# EAGLE design untitled (EAGLE 6.1)
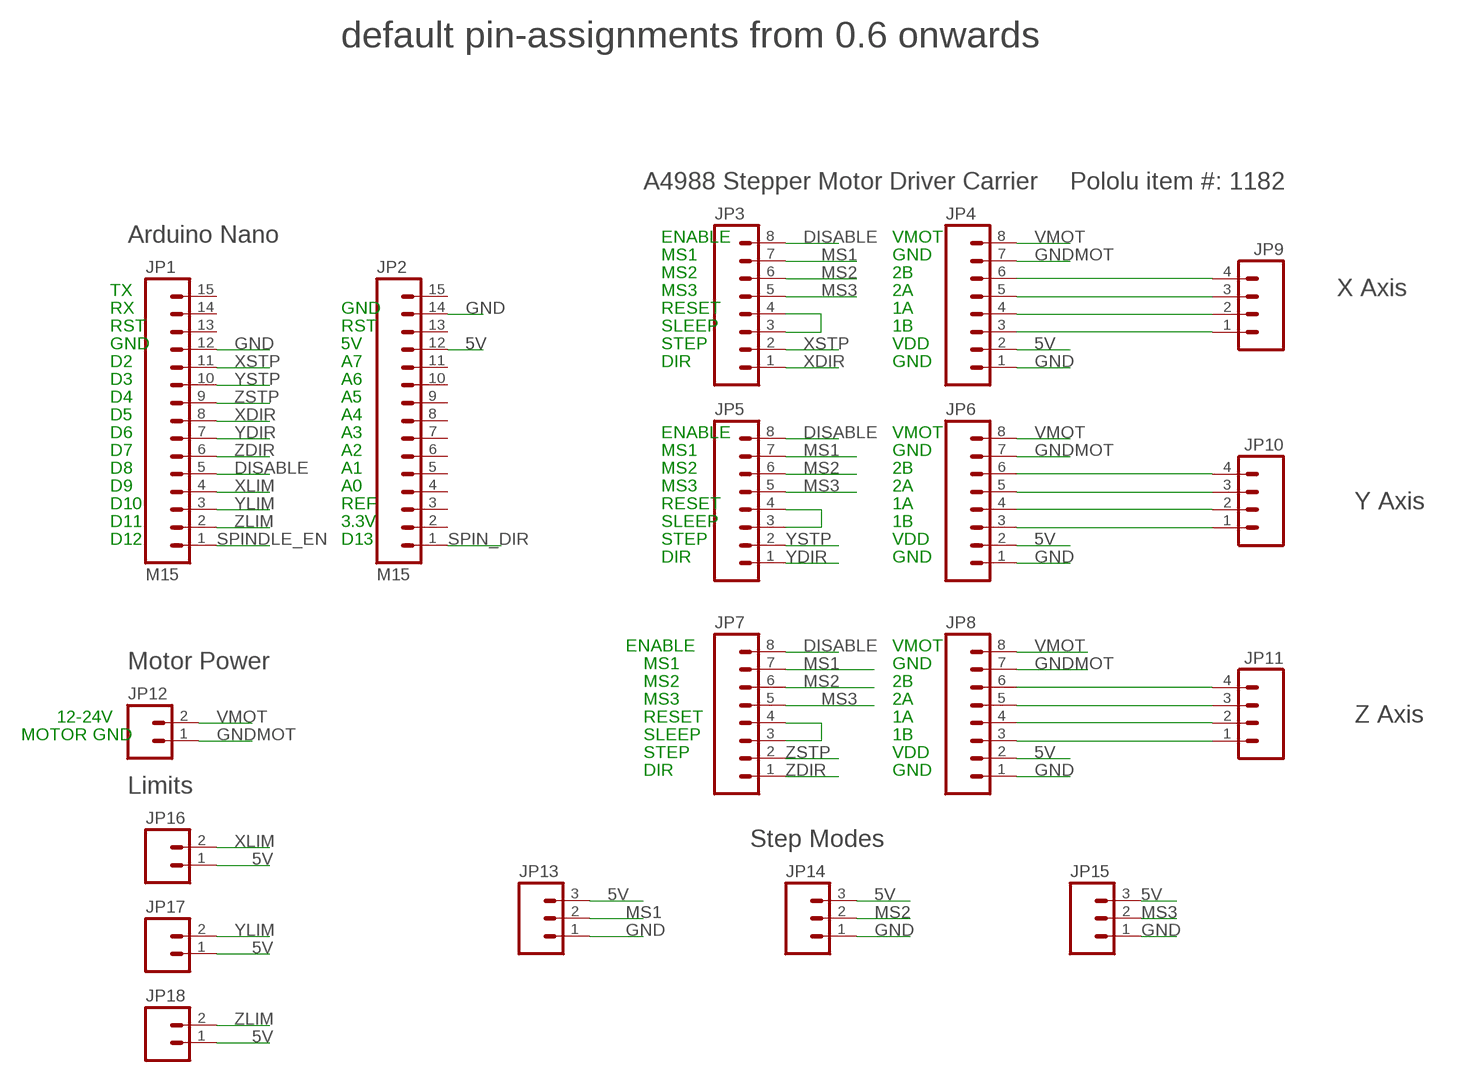
[diagram p0: schematic, sheet 1]

## Parts
JP1  M15  [1X15]
JP2  M15  [1X15]
JP3  M08LONGPADS  [1X08_LONGPADS]
JP4  M08LONGPADS  [1X08_LONGPADS]
JP5  M08LONGPADS  [1X08_LONGPADS]
JP6  M08LONGPADS  [1X08_LONGPADS]
JP7  M08LONGPADS  [1X08_LONGPADS]
JP8  M08LONGPADS  [1X08_LONGPADS]
JP9  M04LONGPADS  [1X04_LONGPADS]
JP10  M04LONGPADS  [1X04_LONGPADS]
JP11  M04LONGPADS  [1X04_LONGPADS]
JP12  M02LOCK_LONGPADS  [1X02_LOCK_LONGPADS]
JP13  M03PTH  [1X03]
JP14  M03PTH  [1X03]
JP15  M03PTH  [1X03]
JP16  M02LOCK_LONGPADS  [1X02_LOCK_LONGPADS]
JP17  M02LOCK_LONGPADS  [1X02_LOCK_LONGPADS]
JP18  M02LOCK_LONGPADS  [1X02_LOCK_LONGPADS]

## Nets
5V: JP2.12 JP4.2 JP6.2 JP8.2 JP13.3 JP14.3 JP15.3 JP16.1 JP17.1 JP18.1
DISABLE: JP1.5 JP3.8 JP5.8 JP7.8
GND: JP1.12 JP2.14 JP4.1 JP6.1 JP8.1 JP13.1 JP14.1 JP15.1
GNDMOT: JP4.7 JP6.7 JP8.7 JP12.1
MS1: JP3.7 JP5.7 JP7.7 JP13.2
MS2: JP3.6 JP5.6 JP7.6 JP14.2
MS3: JP3.5 JP5.5 JP7.5 JP15.2
N$1: JP5.3 JP5.4
N$2: JP4.6 JP9.4
N$3: JP4.5 JP9.3
N$4: JP4.4 JP9.2
N$5: JP4.3 JP9.1
N$6: JP8.6 JP11.4
N$7: JP8.5 JP11.3
N$8: JP8.4 JP11.2
N$9: JP8.3 JP11.1
N$10: JP6.6 JP10.4
N$11: JP6.5 JP10.3
N$12: JP6.4 JP10.2
N$13: JP6.3 JP10.1
N$14: JP7.3 JP7.4
N$15: JP3.3 JP3.4
SPIN_DIR: JP2.1
SPINDLE_EN: JP1.1
VMOT: JP4.8 JP6.8 JP8.8 JP12.2
XDIR: JP1.8 JP3.1
XLIM: JP1.4 JP16.2
XSTP: JP1.11 JP3.2
YDIR: JP1.7 JP5.1
YLIM: JP1.3 JP17.2
YSTP: JP1.10 JP5.2
ZDIR: JP1.6 JP7.1
ZLIM: JP1.2 JP18.2
ZSTP: JP1.9 JP7.2
Unconnected: JP1.13 JP1.14 JP1.15 JP2.2 JP2.3 JP2.4 JP2.5 JP2.6 JP2.7 JP2.8 JP2.9 JP2.10 JP2.11 JP2.13 JP2.15

## Notes on the sheet
- default pin-assignments from 0.6 onwards
- A4988 Stepper Motor Driver Carrier | Pololu item #: 1182
- Arduino Nano | ENABLE | VMOT
- MS1 | GND
- MS2 | 2B
- TX | MS3 | 2A | X Axis
- RX | GND | RESET | 1A
- RST | RST | SLEEP | 1B
- GND | 5V | STEP | VDD
- D2 | A7 | DIR | GND
- D3 | A6
- D4 | A5
- D5 | A4
- D6 | A3 | ENABLE | VMOT
- D7 | A2 | MS1 | GND
- D8 | A1 | MS2 | 2B
- D9 | A0 | MS3 | 2A
- D10 | REF | RESET | 1A | Y Axis
- D11 | 3.3V | SLEEP | 1B
- D12 | D13 | STEP | VDD
- DIR | GND
- ENABLE | VMOT
- Motor Power | MS1 | GND
- MS2 | 2B
- MS3 | 2A
- 12-24V | RESET | 1A | Z Axis
- MOTOR GND | SLEEP | 1B
- STEP | VDD
- DIR | GND
- Limits
- Step Modes

## Library data of the parts
JP1 JP2 = SparkFun:M15: Header 15 Standard 15-pin 0.1" header. Use with straight break away headers (SKU : PRT-00116), right angle break away headers (PRT-00553), swiss pins (PRT-00743), machine pins (PRT-00117), and female headers (PRT-00115).
JP3-JP8 = SparkFun:M08: Header 8 Standard 8-pin 0.1" header. Use with straight break away headers (SKU : PRT-00116), right angle break away headers (PRT-00553), swiss pins (PRT-00743), machine pins (PRT-00117), and female headers (PRT-00115).
JP9-JP11 = SparkFun:M04: Header 4 Standard 4-pin 0.1" header. Use with straight break away headers (SKU : PRT-00116), right angle break away headers (PRT-00553), swiss pins (PRT-00743), machine pins (PRT-00117), and female headers (PRT-00115). Molex polarized connector foot print use with SKU : PRT-08231 with associated crimp pins and housings. 1MM SMD Version SKU: PRT-10208
JP12 JP16-JP18 = SparkFun:M02: Header 2 Standard 2-pin 0.1" header. Use with straight break away headers (SKU : PRT-00116), right angle break away headers (PRT-00553), swiss pins (PRT-00743), machine pins (PRT-00117), and female headers (PRT-00115). Molex polarized connector foot print use with SKU : PRT-08233 with associated crimp pins and housings.
JP13-JP15 = SparkFun:M03: Header 3 Standard 3-pin 0.1" header. Use with straight break away headers (SKU : PRT-00116), right angle break away headers (PRT-00553), swiss pins (PRT-00743), machine pins (PRT-00117), and female headers (PRT-00115). Molex polarized connector foot print use with SKU : PRT-08232 with associated crimp pins and housings.

## Board
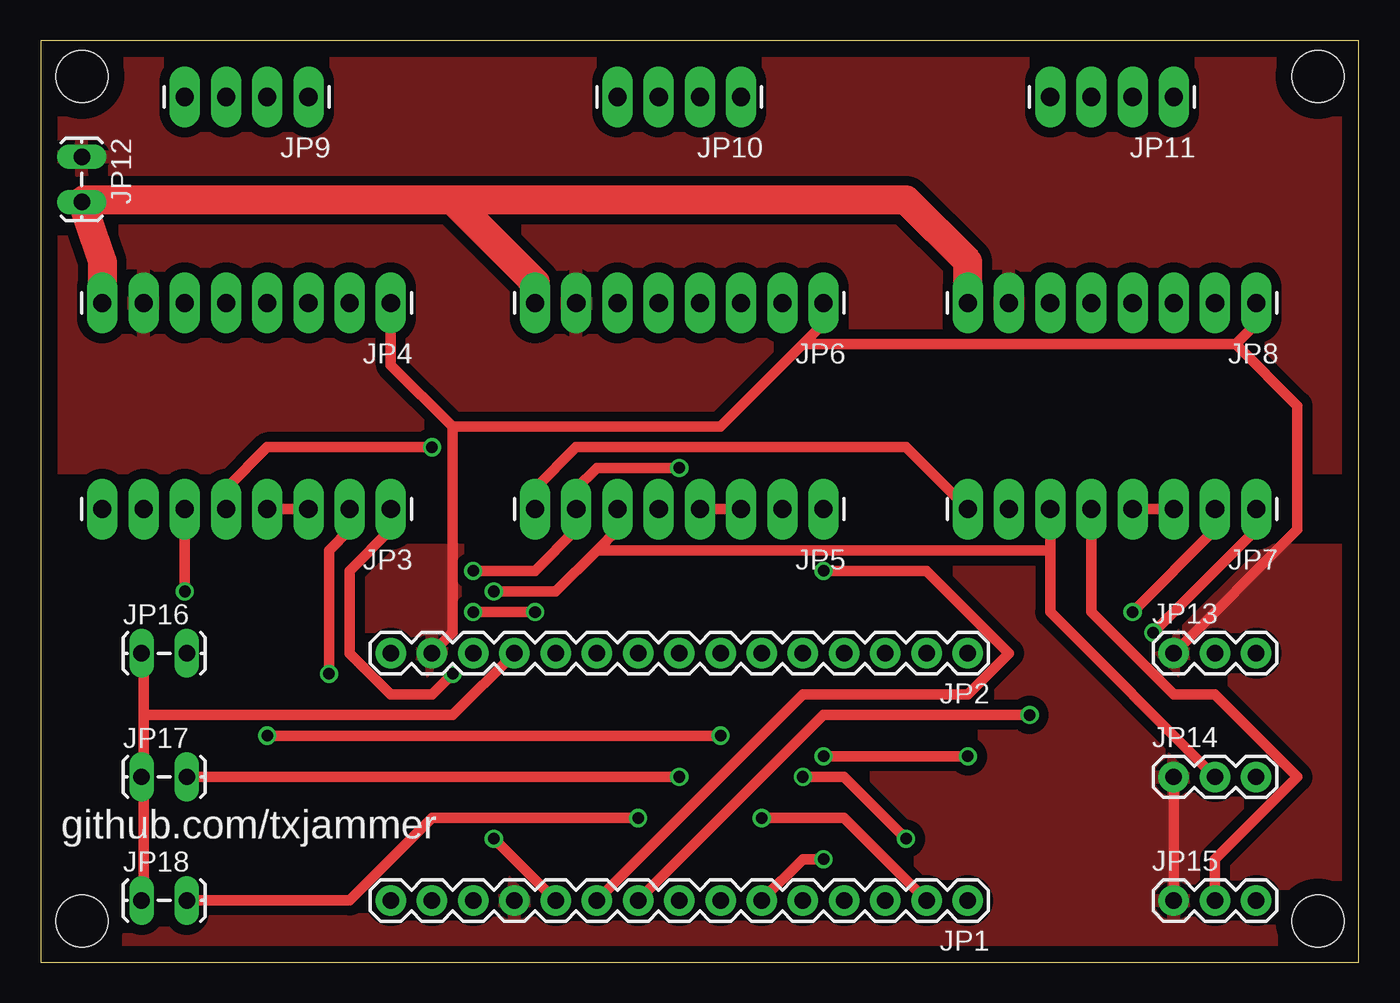
[diagram p1: board, top side]
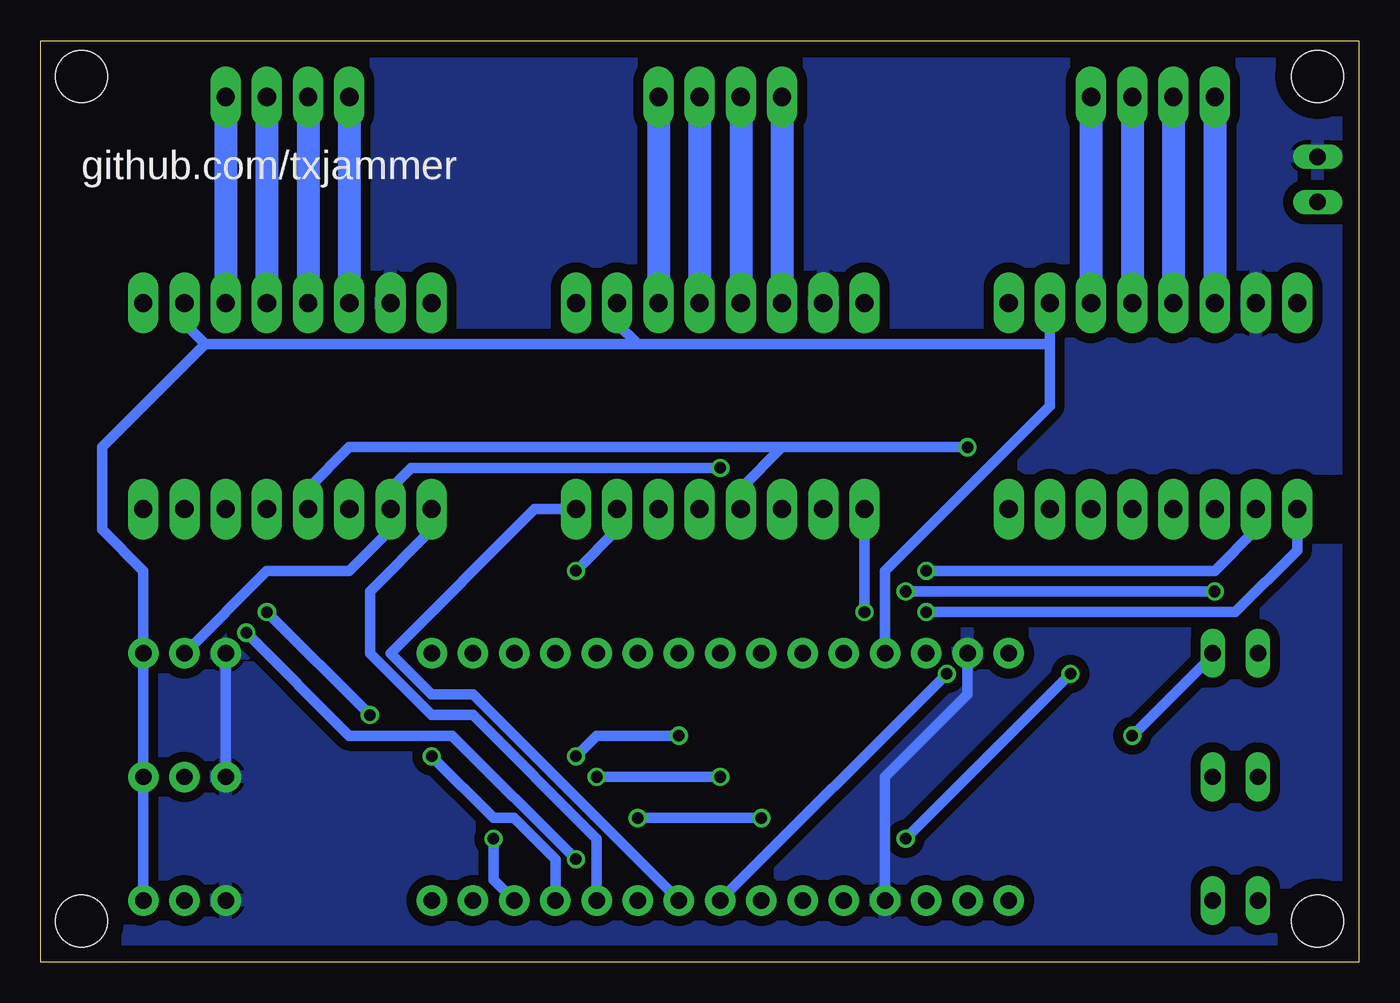
[diagram p2: board, bottom side, seen from below]

Size 81.26 x 56.82 mm. Coordinates in mm from the lower left corner, seen from the top.
Outline: 0,0 81.26,0 81.26,56.82 0,56.82 0,0
Copper layers (1*16): Top 0.035mm / dielectric 1.5mm / Bottom 0.035mm
Design rules: minimum track width 25mil, minimum drill 28mil, track to track 10mil, track to pad 10mil, pad to pad 10mil, via to via 10mil, smd to smd 10mil, copper to edge 40mil, drill to drill 8mil, minimum pad ring 10mil, minimum via ring 8mil, stop-mask expansion 4mil, vias tented up to drill 0mil, thermal gap 10mil
Holes 3.2 mm at 2.54,54.61 78.74,54.61 78.74,2.54 2.54,2.54

### Footprints (pad centres in the part's own frame; a part is rotated, then mirrored left to right if it is on the bottom)
1X15 = drill 1.016 pad 1.88: 1 0,0; 2 2.54,0; 3 5.08,0; 4 7.62,0; 5 10.16,0; 6 12.7,0; 7 15.24,0; 8 17.78,0; 9 20.32,0; 10 22.86,0; 11 25.4,0; 12 27.94,0; 13 30.48,0; 14 33.02,0; 15 35.56,0
1X08_LONGPADS = drill 1.118 pad 1.88 long: 1 0,0; 2 2.54,0; 3 5.08,0; 4 7.62,0; 5 10.16,0; 6 12.7,0; 7 15.24,0; 8 17.78,0
1X04_LONGPADS = drill 1.118 pad 1.88 long: 1 0,0; 2 2.54,0; 3 5.08,0; 4 7.62,0
1X02_LOCK_LONGPADS = drill 1.016 long: 1 -0.127,0; 2 2.667,0
1X03 = drill 1.016 pad 1.88: 1 0,0; 2 2.54,0; 3 5.08,0

### Placement (x,y rotation side)
JP1  57.15,3.81 180 top
JP2  57.15,19.05 180 top
JP3  21.59,27.94 180 top
JP4  21.59,40.64 180 top
JP5  48.26,27.94 180 top
JP6  48.26,40.64 180 top
JP7  74.93,27.94 180 top
JP8  74.93,40.64 180 top
JP9  16.51,53.34 180 top
JP10  43.18,53.34 180 top
JP11  69.85,53.34 180 top
JP12  2.54,49.53 270 top
JP13  69.85,19.05 0 top
JP14  69.85,11.43 0 top
JP15  69.85,3.81 0 top
JP16  6.35,19.05 0 top
JP17  6.35,11.43 0 top
JP18  6.35,3.81 0 top

### Tracks (layer width: path | path; a pad name or v marks a point on that pad's centre or on a via)
5V
  Top 0.635: 6.35,11.43 6.35,3.81 JP18.1 | 6.35,11.43 6.35,15.24 | 6.35,15.24 6.35,19.05 JP16.1 | 6.35,11.43 JP17.1 | JP2.12 25.4,15.24 6.35,15.24
  Bottom 0.635: JP15.3 JP14.3 JP13.3 74.93,24.13 77.47,26.67 77.47,31.75 71.12,38.1 | 19.05,38.1 19.05,34.29 29.21,24.13 JP2.12 | 19.05,38.1 JP4.2 | JP6.2 45.72,39.37 44.45,38.1 | 19.05,38.1 44.45,38.1 | JP8.2 72.39,39.37 71.12,38.1 | 44.45,38.1 71.12,38.1
DISABLE  (via drill 0.71)
  Top 0.635: v30.48,21.59 v26.67,21.59 | JP5.8 30.48,29.21 33.02,31.75 53.34,31.75 JP7.8
  Bottom 0.635: JP3.8 3.81,25.4 7.62,21.59 v26.67,21.59 | JP5.8 v30.48,21.59 | JP1.5 46.99,7.62 54.61,15.24 57.15,15.24 60.96,19.05 60.96,22.86 57.15,26.67 JP7.8
GND
  Top 0.635: JP14.1 JP15.1 | JP4.1 21.59,36.83 25.4,33.02 | 25.4,33.02 25.4,20.32 JP2.14 | JP6.1 48.26,39.37 46.99,38.1 | 46.99,38.1 41.91,33.02 25.4,33.02 | JP8.1 74.93,39.37 73.66,38.1 | 46.99,38.1 73.66,38.1 | JP13.1 77.47,26.67 77.47,34.29 73.66,38.1
  Bottom 0.635: JP14.1 JP13.1 | JP1.12 29.21,11.43 24.13,16.51 JP2.14
  pour Top (isolate 0.61): 81.28,25.4 0,25.4 0,0 81.28,0
  pour Bottom (isolate 0.61): 0,25.4 81.28,25.4 81.28,0 0,0
GNDMOT
  pour Bottom (isolate 0.61): 0,57.15 81.28,57.15 81.28,30.48 0,30.48
  pour Top (isolate 0.61): 0,57.15 81.28,57.15 81.28,30.48 0,30.48
MS1  (via drill 0.71)
  Top 0.635: v26.67,24.13 30.48,24.13 33.02,26.67 JP5.7 33.02,29.21 34.29,30.48 v39.37,30.48
  Bottom 0.635: JP13.2 67.31,24.13 62.23,24.13 59.69,26.67 JP7.7 59.69,29.21 58.42,30.48 v39.37,30.48 | JP3.7 6.35,26.67 8.89,24.13 v26.67,24.13
MS2  (via drill 0.71)
  Top 0.635: JP14.2 62.23,21.59 62.23,25.4 | JP7.6 62.23,25.4 | v8.89,22.86 JP3.6 | v27.94,22.86 31.75,22.86 34.29,25.4 | 34.29,25.4 35.56,26.67 JP5.6 | 34.29,25.4 62.23,25.4
  Bottom 0.635: v27.94,22.86 v8.89,22.86
MS3  (via drill 0.71)
  Top 0.635: JP3.5 11.43,29.21 13.97,31.75 v24.13,31.75 | JP15.2 72.39,6.35 77.47,11.43 72.39,16.51 69.85,16.51 64.77,21.59 JP7.5
  Bottom 0.635: 35.56,31.75 v24.13,31.75 | 35.56,31.75 38.1,29.21 JP5.5 | 35.56,31.75 62.23,31.75 64.77,29.21 JP7.5
N$1
  Top 0.635: JP5.3 JP5.4
N$2
  Bottom 1.422: JP9.4 JP4.6
N$3
  Bottom 1.422: JP9.3 JP4.5
N$4
  Bottom 1.422: JP9.2 JP4.4
N$5
  Bottom 1.422: JP9.1 JP4.3
N$6
  Bottom 1.422: JP11.4 JP8.6
N$7
  Bottom 1.422: JP11.3 JP8.5
N$8
  Bottom 1.422: JP11.2 JP8.4
N$9
  Bottom 1.422: JP11.1 JP8.3
N$10
  Bottom 1.422: JP10.4 JP6.6
N$11
  Bottom 1.422: JP10.3 JP6.5
N$12
  Bottom 1.422: JP10.2 JP6.4
N$13
  Bottom 1.422: JP10.1 JP6.3
N$14
  Top 0.635: JP7.3 JP7.4
N$15
  Top 0.635: JP3.3 JP3.4
VMOT
  Top 1.778: JP4.8 3.81,43.18 JP12.2 2.67,46.99 25.4,46.99 | JP6.8 30.48,41.91 25.4,46.99 | JP8.8 57.15,43.18 53.34,46.99 25.4,46.99
XDIR  (via drill 0.71)
  Top 0.635: v25.4,17.78 24.13,16.51 21.59,16.51 19.05,19.05 19.05,24.13 21.59,26.67 JP3.1
  Bottom 0.635: v25.4,17.78 JP1.8
XLIM  (via drill 0.71)
  Top 0.635: v41.91,13.97 v13.97,13.97 | v57.15,12.7 v48.26,12.7
  Bottom 0.635: v13.97,13.97 8.89,19.05 JP16.2 | v41.91,13.97 46.99,13.97 v48.26,12.7 | v57.15,12.7 53.34,8.89 52.07,8.89 49.53,6.35 JP1.4
XSTP  (via drill 0.71)
  Top 0.635: v27.94,7.62 JP1.11 | v17.78,17.78 17.78,25.4 19.05,26.67 JP3.2
  Bottom 0.635: v17.78,17.78 v27.94,7.62
YDIR
  Bottom 0.635: JP1.7 54.61,16.51 57.15,16.51 59.69,19.05 50.8,27.94 JP5.1
YLIM  (via drill 0.71)
  Top 0.635: v39.37,11.43 JP17.2 8.89,11.43 | v46.99,11.43 49.53,11.43 v53.34,7.62
  Bottom 0.635: v46.99,11.43 v39.37,11.43 | v53.34,7.62 53.34,5.08 JP1.3
YSTP  (via drill 0.71)
  Top 0.635: JP1.10 46.99,16.51 57.15,16.51 59.69,19.05 54.61,24.13 v48.26,24.13
  Bottom 0.635: v48.26,24.13 45.72,26.67 JP5.2
ZDIR  (via drill 0.71)
  Top 0.635: JP1.6 46.99,6.35 v48.26,6.35 | v68.58,20.32 74.93,26.67 JP7.1
  Bottom 0.635: v48.26,6.35 55.88,13.97 62.23,13.97 v68.58,20.32
ZLIM  (via drill 0.71)
  Top 0.635: v36.83,8.89 24.13,8.89 19.05,3.81 JP18.2 8.89,3.81 | v44.45,8.89 49.53,8.89 JP1.2
  Bottom 0.635: v44.45,8.89 v36.83,8.89
ZSTP  (via drill 0.71)
  Top 0.635: JP1.9 48.26,15.24 v60.96,15.24 | v67.31,21.59 72.39,26.67 JP7.2
  Bottom 0.635: v67.31,21.59 v60.96,15.24

### Text on the board
tNames: github.com/txjammer
bNames: github.com/txjammer